# EAGLE design Display (EAGLE 7.3.0)
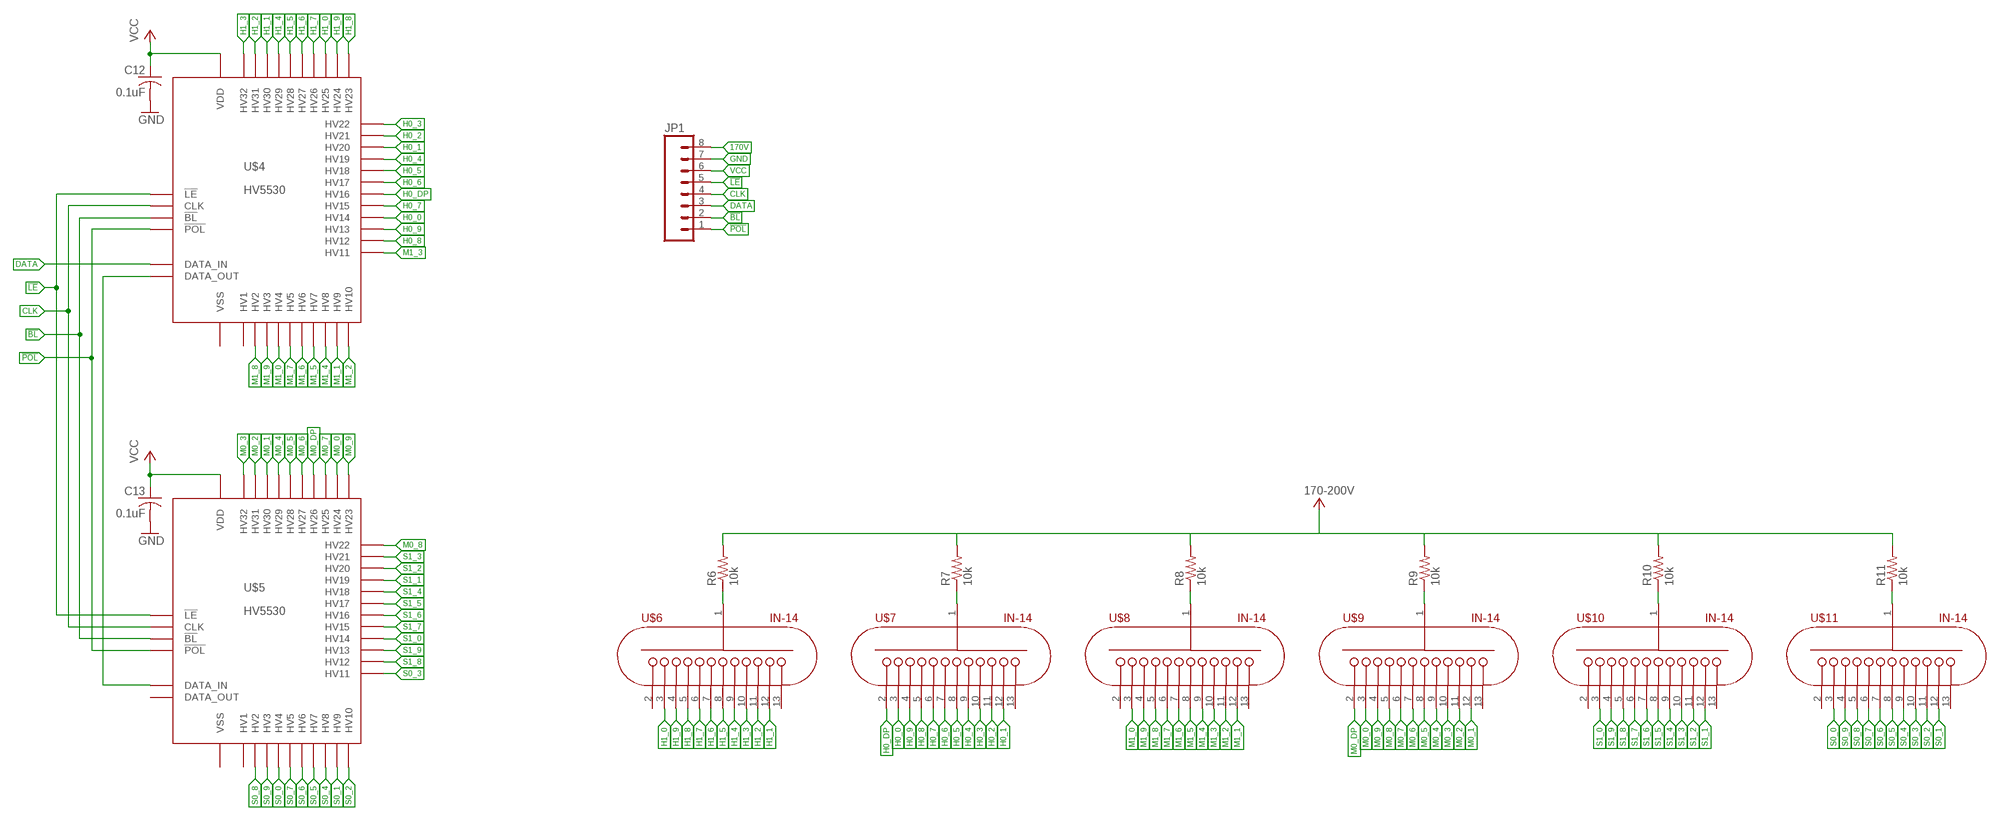
[diagram p0: schematic, sheet 1]

## Parts
C12  0.1uF  C-USC0603  [C0603]
C13  0.1uF  C-USC0603  [C0603]
JP1  M08  [1X08_PIN1_NO_SILK]
R6  10k  R-US_R0603  [R0603]
R7  10k  R-US_R0603  [R0603]
R8  10k  R-US_R0603  [R0603]
R9  10k  R-US_R0603  [R0603]
R10  10k  R-US_R0603  [R0603]
R11  10k  R-US_R0603  [R0603]
U$4  HV5530PLCC  [PLCC]
U$5  HV5530PLCC  [PLCC]
U$6  IN-14  [IN-14]
U$7  IN-14  [IN-14]
U$8  IN-14  [IN-14]
U$9  IN-14  [IN-14]
U$10  IN-14  [IN-14]
U$11  IN-14  [IN-14]

## Nets
170V: JP1.8 R6.2 R7.2 R8.2 R9.2 R10.2 R11.2 ; supply symbol labelled 170-200V
!BL: JP1.2 U$4.BL(!BL) U$5.BL(!BL)
!LE: JP1.5 U$4.LE(!LE) U$5.LE(!LE)
!POL: JP1.1 U$4.POL(!POL) U$5.POL(!POL)
CLK: JP1.4 U$4.CLK U$5.CLK
DATA: JP1.3 U$4.D_IN(DATA_IN)
GND: C12.2 C13.2 JP1.7
H0_0: U$4.HV14 U$7.3
H0_1: U$4.HV20 U$7.12
H0_2: U$4.HV21 U$7.11
H0_3: U$4.HV22 U$7.10
H0_4: U$4.HV19 U$7.9
H0_5: U$4.HV18 U$7.8
H0_6: U$4.HV17 U$7.7
H0_7: U$4.HV15 U$7.6
H0_8: U$4.HV12 U$7.5
H0_9: U$4.HV13 U$7.4
H0_DP: U$4.HV16 U$7.2
H1_0: U$4.HV25 U$6.3
H1_1: U$4.HV30 U$6.12
H1_2: U$4.HV31 U$6.11
H1_3: U$4.HV32 U$6.10
H1_4: U$4.HV29 U$6.9
H1_5: U$4.HV28 U$6.8
H1_6: U$4.HV27 U$6.7
H1_7: U$4.HV26 U$6.6
H1_8: U$4.HV23 U$6.5
H1_9: U$4.HV24 U$6.4
M0_0: U$5.HV24 U$9.3
M0_1: U$5.HV30 U$9.12
M0_2: U$5.HV31 U$9.11
M0_3: U$5.HV32 U$9.10
M0_4: U$5.HV29 U$9.9
M0_5: U$5.HV28 U$9.8
M0_6: U$5.HV27 U$9.7
M0_7: U$5.HV25 U$9.6
M0_8: U$5.HV22 U$9.5
M0_9: U$5.HV23 U$9.4
M0_DP: U$5.HV26 U$9.2
M1_0: U$4.HV4 U$8.3
M1_1: U$4.HV9 U$8.12
M1_2: U$4.HV10 U$8.11
M1_3: U$4.HV11 U$8.10
M1_4: U$4.HV8 U$8.9
M1_5: U$4.HV7 U$8.8
M1_6: U$4.HV6 U$8.7
M1_7: U$4.HV5 U$8.6
M1_8: U$4.HV2 U$8.5
M1_9: U$4.HV3 U$8.4
N$10: R6.1 U$6.1
N$18: R9.1 U$9.1
N$19: R10.1 U$10.1
N$20: R11.1 U$11.1
N$29: U$4.D_OUT(DATA_OUT) U$5.D_IN(DATA_IN)
N$31: R7.1 U$7.1
N$32: R8.1 U$8.1
S0_0: U$5.HV4 U$11.3
S0_1: U$5.HV9 U$11.12
S0_2: U$5.HV10 U$11.11
S0_3: U$5.HV11 U$11.10
S0_4: U$5.HV8 U$11.9
S0_5: U$5.HV7 U$11.8
S0_6: U$5.HV6 U$11.7
S0_7: U$5.HV5 U$11.6
S0_8: U$5.HV2 U$11.5
S0_9: U$5.HV3 U$11.4
S1_0: U$5.HV14 U$10.3
S1_1: U$5.HV19 U$10.12
S1_2: U$5.HV20 U$10.11
S1_3: U$5.HV21 U$10.10
S1_4: U$5.HV18 U$10.9
S1_5: U$5.HV17 U$10.8
S1_6: U$5.HV16 U$10.7
S1_7: U$5.HV15 U$10.6
S1_8: U$5.HV12 U$10.5
S1_9: U$5.HV13 U$10.4
VCC: C12.1 C13.1 JP1.6 U$4.VDD U$5.VDD
Unconnected: U$4.HV1 U$4.VSS U$5.D_OUT(DATA_OUT) U$5.HV1 U$5.VSS U$6.2 U$6.13 U$7.13 U$8.2 U$8.13 U$9.13 U$10.2 U$10.13 U$11.2 U$11.13

## Notes on the sheet
- HV5530
- HV5530

## Library data of the parts
C12 C13 = resistor:C-US: CAPACITOR, American symbol
JP1 = SparkFun-Connectors:M08: Header 8 Standard 8-pin 0.1" header. Use with straight break away headers (SKU : PRT-00116), right angle break away headers (PRT-00553), swiss pins (PRT-00743), machine pins (PRT-00117), and female headers (PRT-00115).
R6-R11 = resistor:R-US_: RESISTOR, American symbol
U$4 U$5 = Alex:HV5530
U$6-U$11 = Alex:IN-14

## Board
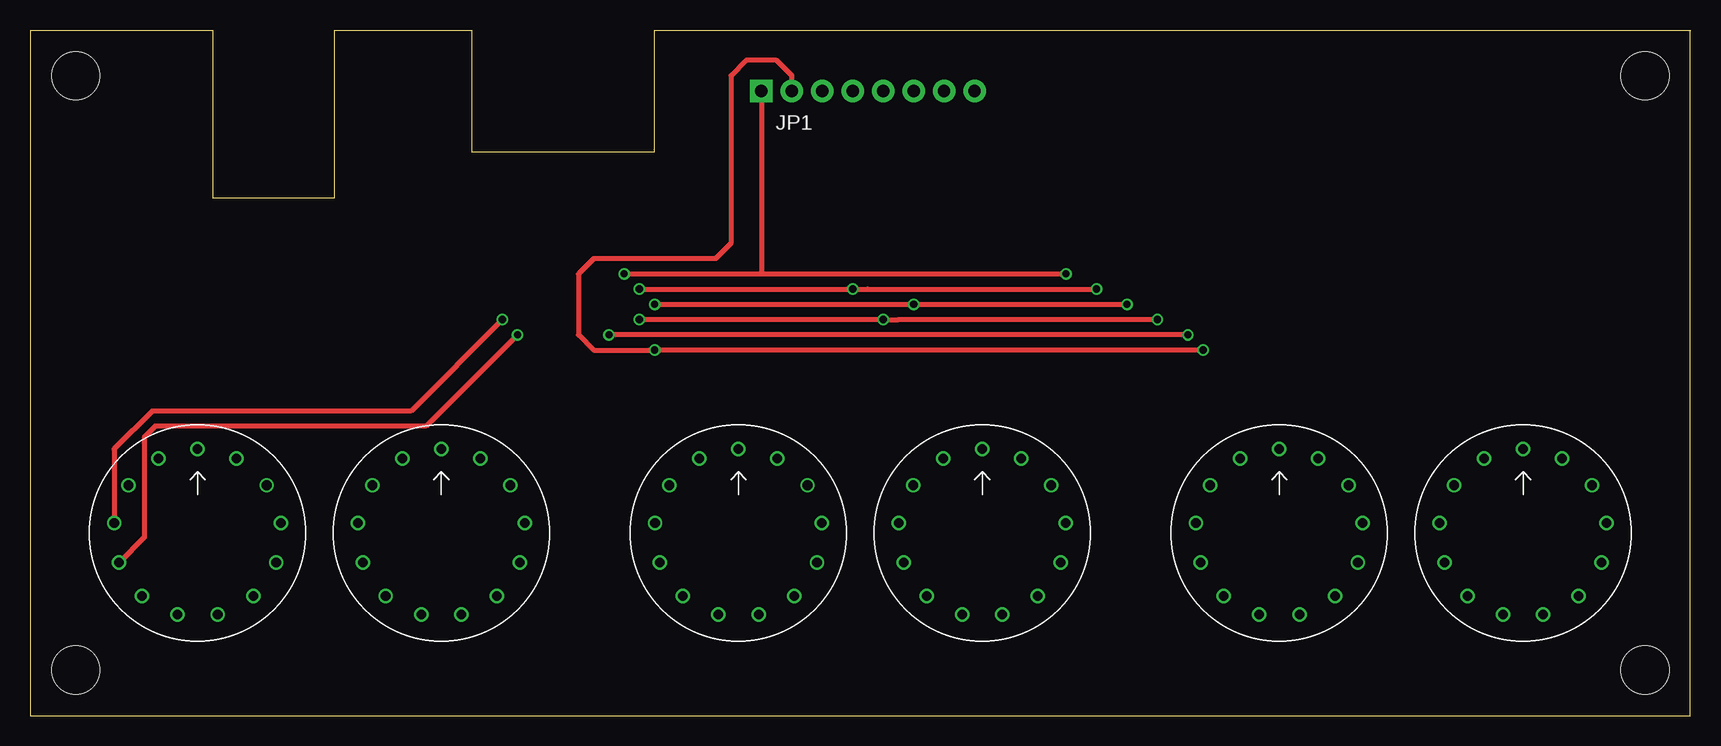
[diagram p1: board, top side]
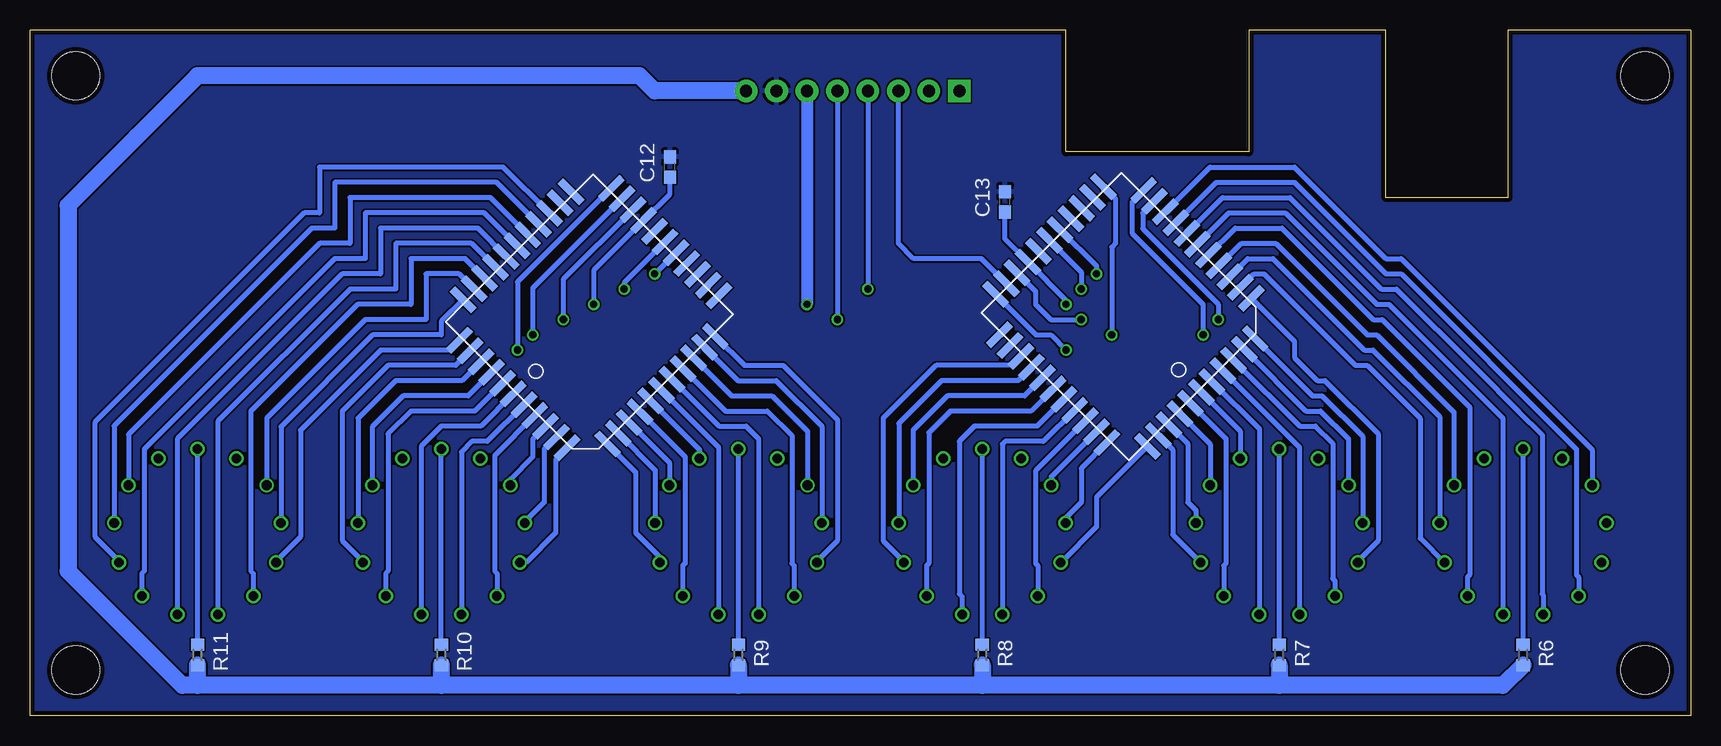
[diagram p2: board, bottom side, seen from below]

Size 138.43 x 57.15 mm. Coordinates in mm from the lower left corner, seen from the top.
Outline: 138.41,57.15 138.41,0 0,0 0,57.15 15.24,57.15 15.24,43.18 25.4,43.18 25.4,57.15 36.83,57.15 36.83,46.99 52.07,46.99 52.07,57.15 138.43,57.15
Copper layers (1*16): Top 0.0356mm / dielectric 1.5011mm / Bottom 0.0356mm
Design rules "OSHpark": minimum track width 6mil, minimum drill 13mil, track to track 6mil, track to pad 6mil, pad to pad 6mil, via to via 6mil, smd to smd 6mil, copper to edge 15mil, drill to drill 6mil, minimum pad ring 7mil, minimum via ring 7mil, stop-mask expansion 3mil, vias tented up to drill 0mil, thermal gap 10mil
Holes 4 mm at 3.81,53.34 134.62,53.34 134.62,3.81 3.81,3.81

### Footprints (pad centres in the part's own frame; a part is rotated, then mirrored left to right if it is on the bottom)
C0603 = smd 1.1 x 1: 1 -0.85,0; 2 0.85,0
1X08_PIN1_NO_SILK = drill 1.016 pad 1.88 square: 1 0,0 | drill 1.016 pad 1.88: 2 2.54,0; 3 5.08,0; 4 7.62,0; 5 10.16,0; 6 12.7,0; 7 15.24,0; 8 17.78,0
R0603 = smd 1 x 1.1: 1 -0.85,0; 2 0.85,0
PLCC = smd 0.635 x 2.54: BL 14.605,-0.254; CLK 8.255,-0.254; D_IN 13.335,-0.254; D_OUT 1.905,-0.254; HV11 14.605,17.653; HV12 13.335,17.653; HV13 12.065,17.653; HV14 10.795,17.653; HV15 9.525,17.653; HV16 8.255,17.653; HV17 6.985,17.653; HV18 5.715,17.653; HV19 4.445,17.653; HV20 3.175,17.653; HV21 1.905,17.653; LE 12.065,-0.254; NC 3.175,-0.254; NC1 4.445,-0.254; NC2 5.715,-0.254; POL 6.985,-0.254; VDD 10.795,-0.254; VSS 9.525,-0.254 | smd 2.54 x 0.635: HV1 16.764,3.619; HV2 16.764,4.889; HV3 16.764,6.16; HV4 16.764,7.429; HV5 16.764,8.7; HV6 16.764,9.97; HV7 16.764,11.239; HV8 16.764,12.509; HV9 16.764,13.78; HV10 16.764,15.05; HV22 -0.254,15.05; HV23 -0.254,13.78; HV24 -0.254,12.509; HV25 -0.254,11.239; HV26 -0.254,9.97; HV27 -0.254,8.7; HV28 -0.254,7.429; HV29 -0.254,6.16; HV30 -0.254,4.889; HV31 -0.254,3.619; HV32 -0.254,2.349; NC3 16.764,2.349
IN-14 = drill 0.8: 1 0,6.985; 2 3.25,6.2; 3 5.76,3.97; 4 6.95,0.84; 5 6.55,-2.48; 6 4.64,-5.24; 7 1.68,-6.8; 8 -1.68,-6.8; 9 -4.64,-5.24; 10 -6.55,-2.48; 11 -6.95,0.84; 12 -5.76,3.97; 13 -3.25,6.2

### Placement (x,y rotation side)
C12  85.09,45.72 90 bottom
C13  57.15,42.83 90 bottom
JP1  60.96,52.07 0 top
R6  13.97,5.08 270 bottom
R7  34.29,5.08 270 bottom
R8  59.05,5.08 270 bottom
R9  79.38,5.08 270 bottom
R10  104.14,5.08 270 bottom
R11  124.46,5.08 270 bottom
U$4  47.44,45.27 225 bottom
U$5  79.82,33.47 135 bottom
U$6  13.97,15.24 0 top
U$7  34.29,15.24 0 top
U$8  59.05,15.24 0 top
U$9  79.38,15.24 0 top
U$10  104.14,15.24 0 top
U$11  124.46,15.24 0 top

### Tracks (layer width: path | path; a pad name or v marks a point on that pad's centre or on a via)
170V
  Bottom 1.422: R6.2 15.66,2.54 34.29,2.54 | R7.2 34.29,2.54 | 34.29,2.54 59.05,2.54 | R8.2 59.05,2.54 | 59.05,2.54 79.38,2.54 | R9.2 79.38,2.54 | 79.38,2.54 104.14,2.54 | R10.2 104.14,2.54 | 104.14,2.54 124.46,2.54 | 124.46,2.54 R11.2 | JP1.8 86.36,52.07 87.63,53.34 124.46,53.34 129.54,48.26 135.25,42.55 135.25,12.06 130.81,7.62 125.73,2.54 124.46,2.54
!BL  (via drill 0.6 pad 0.25)
  Top 0.406: v97.79,30.48 v52.07,30.48 46.99,30.48 45.72,31.75 45.72,36.83 46.99,38.1 57.15,38.1 58.42,39.37 58.42,53.34 59.69,54.61 62.23,54.61 63.5,53.34 JP1.2
  Bottom 0.406: U$5.BL 97.79,36.16 v97.79,30.48 | U$4.BL 54.61,31.79 54.61,31.75 53.34,31.75 v52.07,30.48
!LE  (via drill 0.6 pad 0.25)
  Top 0.406: v93.98,33.02 72.39,33.02 v71.12,33.02 v50.8,33.02
  Bottom 0.406: U$5.LE 93.98,36.38 v93.98,33.02 | U$4.LE 54.61,35.38 54.61,34.29 53.34,33.02 v50.8,33.02 | JP1.5 v71.12,33.02
!POL  (via drill 0.6 pad 0.25)
  Top 0.406: v49.53,36.83 60.96,36.83 | 60.96,36.83 v86.36,36.83 | JP1.1 60.96,36.83
  Bottom 0.406: U$5.POL 86.34,36.83 v86.36,36.83 | U$4.POL 49.53,37.48 v49.53,36.83
CLK  (via drill 0.6 pad 0.25)
  Top 0.406: v50.8,35.56 v68.58,35.56 69.85,35.56 v88.9,35.56
  Bottom 0.406: U$5.CLK 88.9,36.07 v88.9,35.56 | U$4.CLK 50.8,36.96 v50.8,35.56 | JP1.4 v68.58,35.56
DATA
  Bottom 0.406: U$4.D_IN 59.13,38.1 64.77,38.1 66.04,39.37 JP1.3
GND
  pour Bottom: -1.27,58.42 139.7,58.42 139.7,-1.27 -1.27,-1.27
H0_0
  Bottom 0.406: U$4.HV14 40.05,22.62 U$7.3
H0_1
  Bottom 0.406: U$4.HV20 32.06,25.4 30.86,25.4 28.53,23.07 U$7.12
H0_2
  Bottom 0.406: U$4.HV21 31.53,26.67 30.73,26.67 27.34,23.28 U$7.11
H0_3
  Bottom 0.406: U$4.HV22 33.02,31.21 33.02,29.84 31.11,27.94 30.48,27.94 26.04,23.5 26.04,14.61 27.74,12.9 U$7.10
H0_4
  Bottom 0.406: U$4.HV19 32.58,24.13 31.27,24.13 29.84,22.71 29.84,11.43 29.65,11.23 U$7.9
H0_5
  Bottom 0.406: U$4.HV18 32.61,22.36 U$7.8
H0_6
  Bottom 0.406: U$4.HV17 35.97,23.92 U$7.7
H0_7
  Bottom 0.406: U$4.HV15 38.73,23.1 38.73,12.7 38.93,12.51 U$7.6
H0_8
  Bottom 0.406: U$4.HV12 43.18,22.15 43.18,15.1 U$7.5
H0_9
  Bottom 0.406: U$4.HV13 41.91,22.68 41.91,17.78 41.24,17.11 U$7.4
H0_DP
  Bottom 0.406: U$4.HV16 37.54,23.7 U$7.2
H1_0
  Bottom 0.406: U$4.HV25 37.45,39.37 34.59,39.37 26.97,31.75 26.17,31.75 19.73,25.31 U$6.3
H1_1
  Bottom 0.406: U$4.HV30 40.08,45.72 33.02,45.72 25.4,38.1 24.13,38.1 8.21,22.18 U$6.12
H1_2  (via drill 0.6)
  Top 0.406: v39.37,33.02 31.75,25.4 10.17,25.4 7.02,22.25 U$6.11
  Bottom 0.406: U$4.HV31 45.68,41.92 45.68,40.6 39.37,34.29 v39.37,33.02
H1_3  (via drill 0.6)
  Top 0.406: v40.64,31.75 33.02,24.13 10.42,24.13 9.53,23.23 9.53,14.87 U$6.10
  Bottom 0.406: U$4.HV32 46.57,42.81 46.57,40.22 40.64,34.29 v40.64,31.75
H1_4
  Bottom 0.406: U$4.HV29 39.55,44.45 33.02,44.45 25.4,36.83 24.13,36.83 9.53,22.23 9.53,11.75 9.33,11.55 U$6.9
H1_5
  Bottom 0.406: U$4.HV28 39.02,43.18 33.4,43.18 27.94,37.72 25.78,35.56 24.52,35.56 17.78,28.82 14.36,25.4 12.38,23.43 12.38,10.16 12.29,10.07 U$6.8
H1_6
  Bottom 0.406: U$4.HV27 38.5,41.91 33.79,41.91 26.17,34.29 25.15,34.29 15.65,24.79 U$6.7
H1_7
  Bottom 0.406: U$4.HV26 37.97,40.64 34.07,40.64 26.45,33.02 25.71,33.02 18.41,25.73 18.41,11.75 18.61,11.55 U$6.6
H1_8
  Bottom 0.406: U$4.HV23 36.39,36.83 35.56,36.83 27.94,29.21 26.97,29.21 22.54,24.78 22.54,14.78 U$6.5
H1_9
  Bottom 0.406: U$4.HV24 36.92,38.1 34.82,38.1 27.2,30.48 26.48,30.48 20.92,24.92 U$6.4
M0_0
  Bottom 0.406: U$5.HV24 85.14,21.09 U$9.3
M0_1
  Bottom 0.406: U$5.HV30 79.94,26.67 76.58,26.67 73.61,23.71 U$9.12
M0_2
  Bottom 0.406: U$5.HV31 79.41,27.94 76.22,27.94 72.42,24.14 U$9.11
M0_3
  Bottom 0.406: U$5.HV32 78.89,29.21 75.65,29.21 71.12,24.68 71.12,14.61 72.83,12.9 U$9.10
M0_4
  Bottom 0.406: U$5.HV29 80.47,25.4 76.96,25.4 74.93,23.37 74.93,12.7 74.73,12.51 U$9.9
M0_5
  Bottom 0.406: U$5.HV28 80.99,24.13 78.74,24.13 77.69,23.09 U$9.8
M0_6
  Bottom 0.406: U$5.HV27 81.52,22.86 81.06,22.4 U$9.7
M0_7
  Bottom 0.406: U$5.HV25 83.82,21.57 83.82,12.7 84.02,12.51 U$9.6
M0_8
  Bottom 0.406: U$5.HV22 87.95,20.31 87.95,15.24 85.92,13.22 U$9.5
M0_9
  Bottom 0.406: U$5.HV23 86.33,20.48 U$9.4
M0_DP
  Bottom 0.406: U$5.HV26 82.62,22.17 U$9.2
M1_0
  Bottom 0.406: U$4.HV4 55.53,26.67 61.95,26.67 64.81,23.81 U$8.3
M1_1
  Bottom 0.406: U$4.HV9 53.3,19.93 U$8.12
M1_2
  Bottom 0.406: U$4.HV10 50.8,20.63 50.8,17.78 52.1,16.48 U$8.11
M1_3
  Bottom 0.406: U$4.HV11 49.53,18.21 49.53,15.73 U$8.10
M1_4
  Bottom 0.406: U$4.HV8 54.61,20.41 54.61,12.7 54.41,12.51 U$8.9
M1_5
  Bottom 0.406: U$4.HV7 53.95,22.86 57.15,22.86 57.38,22.64 U$8.8
M1_6
  Bottom 0.406: U$4.HV6 54.48,24.13 59.69,24.13 60.96,22.86 60.96,10.16 60.73,9.94 U$8.7
M1_7
  Bottom 0.406: U$4.HV5 55.01,25.4 61.7,25.4 63.5,23.6 63.5,12.7 63.7,12.51 U$8.6
M1_8
  Bottom 0.406: U$4.HV2 56.59,29.21 62.9,29.21 67.31,24.8 67.31,14.61 65.61,12.9 U$8.5
M1_9
  Bottom 0.406: U$4.HV3 56.06,27.94 62.44,27.94 66,24.37 U$8.4
N$10
  Bottom 0.406: R6.1 U$6.1
N$18
  Bottom 0.406: R9.1 U$9.1
N$19
  Bottom 0.406: R10.1 U$10.1
N$20
  Bottom 0.406: R11.1 U$11.1
N$29  (via drill 0.6 pad 0.25)
  Top 0.406: v96.52,31.75 v48.26,31.75
  Bottom 0.406: U$5.D_IN 96.52,35.63 v96.52,31.75 | U$4.D_OUT 47.94,43.08 47.94,39.37 48.26,39.05 v48.26,31.75
N$31
  Bottom 0.406: R7.1 U$7.1
N$32
  Bottom 0.406: R8.1 U$8.1
S0_0
  Bottom 0.406: U$5.HV4 100.04,43.18 111.76,43.18 111.76,39.37 114.3,39.37 128.27,25.4 130.22,23.45 U$11.3
S0_1
  Bottom 0.406: U$5.HV9 102.67,36.83 105.41,36.83 105.41,33.02 110.49,33.02 118.7,24.81 U$11.12
S0_2
  Bottom 0.406: U$5.HV10 104.14,32.86 104.14,31.75 109.86,31.75 117.51,24.09 U$11.11
S0_3
  Bottom 0.406: U$5.HV11 103.47,30.48 109.22,30.48 115.89,23.81 115.89,14.92 117.91,12.9 U$11.10
S0_4
  Bottom 0.406: U$5.HV8 102.15,38.1 106.68,38.1 106.68,34.29 111.12,34.29 120.02,25.4 120.02,12.06 119.82,11.87 U$11.9
S0_5
  Bottom 0.406: U$5.HV7 101.62,39.37 107.95,39.37 107.95,35.56 111.76,35.56 122.78,24.54 U$11.8
S0_6
  Bottom 0.406: U$5.HV6 101.09,40.64 109.22,40.64 109.22,36.83 112.39,36.83 126.14,23.09 U$11.7
S0_7
  Bottom 0.406: U$5.HV5 100.57,41.91 110.49,41.91 110.49,38.1 113.03,38.1 128.91,22.23 128.91,12.06 129.1,11.87 U$11.6
S0_8
  Bottom 0.406: U$5.HV2 98.99,45.72 114.3,45.72 114.3,41.91 115.57,41.91 133.03,24.45 133.03,14.92 131.01,12.9 U$11.5
S0_9
  Bottom 0.406: U$5.HV3 99.52,44.45 113.03,44.45 113.03,40.64 114.94,40.64 128.91,26.67 131.41,24.16 U$11.4
S1_0
  Bottom 0.406: U$5.HV14 101.89,26.67 107.31,26.67 109.9,24.09 U$10.3
S1_1
  Bottom 0.406: U$5.HV19 96.52,23.06 96.52,21.59 98.38,19.73 U$10.12
S1_2
  Bottom 0.406: U$5.HV20 95.57,22.22 95.57,17.78 97.19,16.16 U$10.11
S1_3
  Bottom 0.406: U$5.HV21 94.61,21.37 94.61,15.24 97.09,12.76 U$10.10
S1_4
  Bottom 0.406: U$5.HV18 99.69,21.68 99.69,12.06 99.5,11.87 U$10.9
S1_5
  Bottom 0.406: U$5.HV17 100.31,22.86 101.6,22.86 102.46,22 U$10.8
S1_6
  Bottom 0.406: U$5.HV16 100.84,24.13 104.14,24.13 105.82,22.45 U$10.7
S1_7
  Bottom 0.406: U$5.HV15 101.36,25.4 106.68,25.4 108.58,23.5 108.58,12.06 108.78,11.87 U$10.6
S1_8
  Bottom 0.406: U$5.HV12 102.94,29.21 108.58,29.21 112.39,25.4 112.39,14.61 110.69,12.9 U$10.5
S1_9
  Bottom 0.406: U$5.HV13 102.42,27.94 107.95,27.94 111.09,24.8 U$10.4
VCC  (via drill 0.6 pad 0.25)
  Top 0.406: v52.07,34.29 v73.66,34.29 74.93,34.29 v91.44,34.29
  Bottom 0.406: v91.44,34.29 91.44,37.12 U$5.VDD 85.09,43.47 C12.1 | v52.07,34.29 52.07,34.64 U$4.VDD 57.15,39.72 C13.1
  Bottom 1.016: JP1.6 v73.66,34.29